# EAGLE design picoAva-Rev3-Boost (EAGLE 6.2)
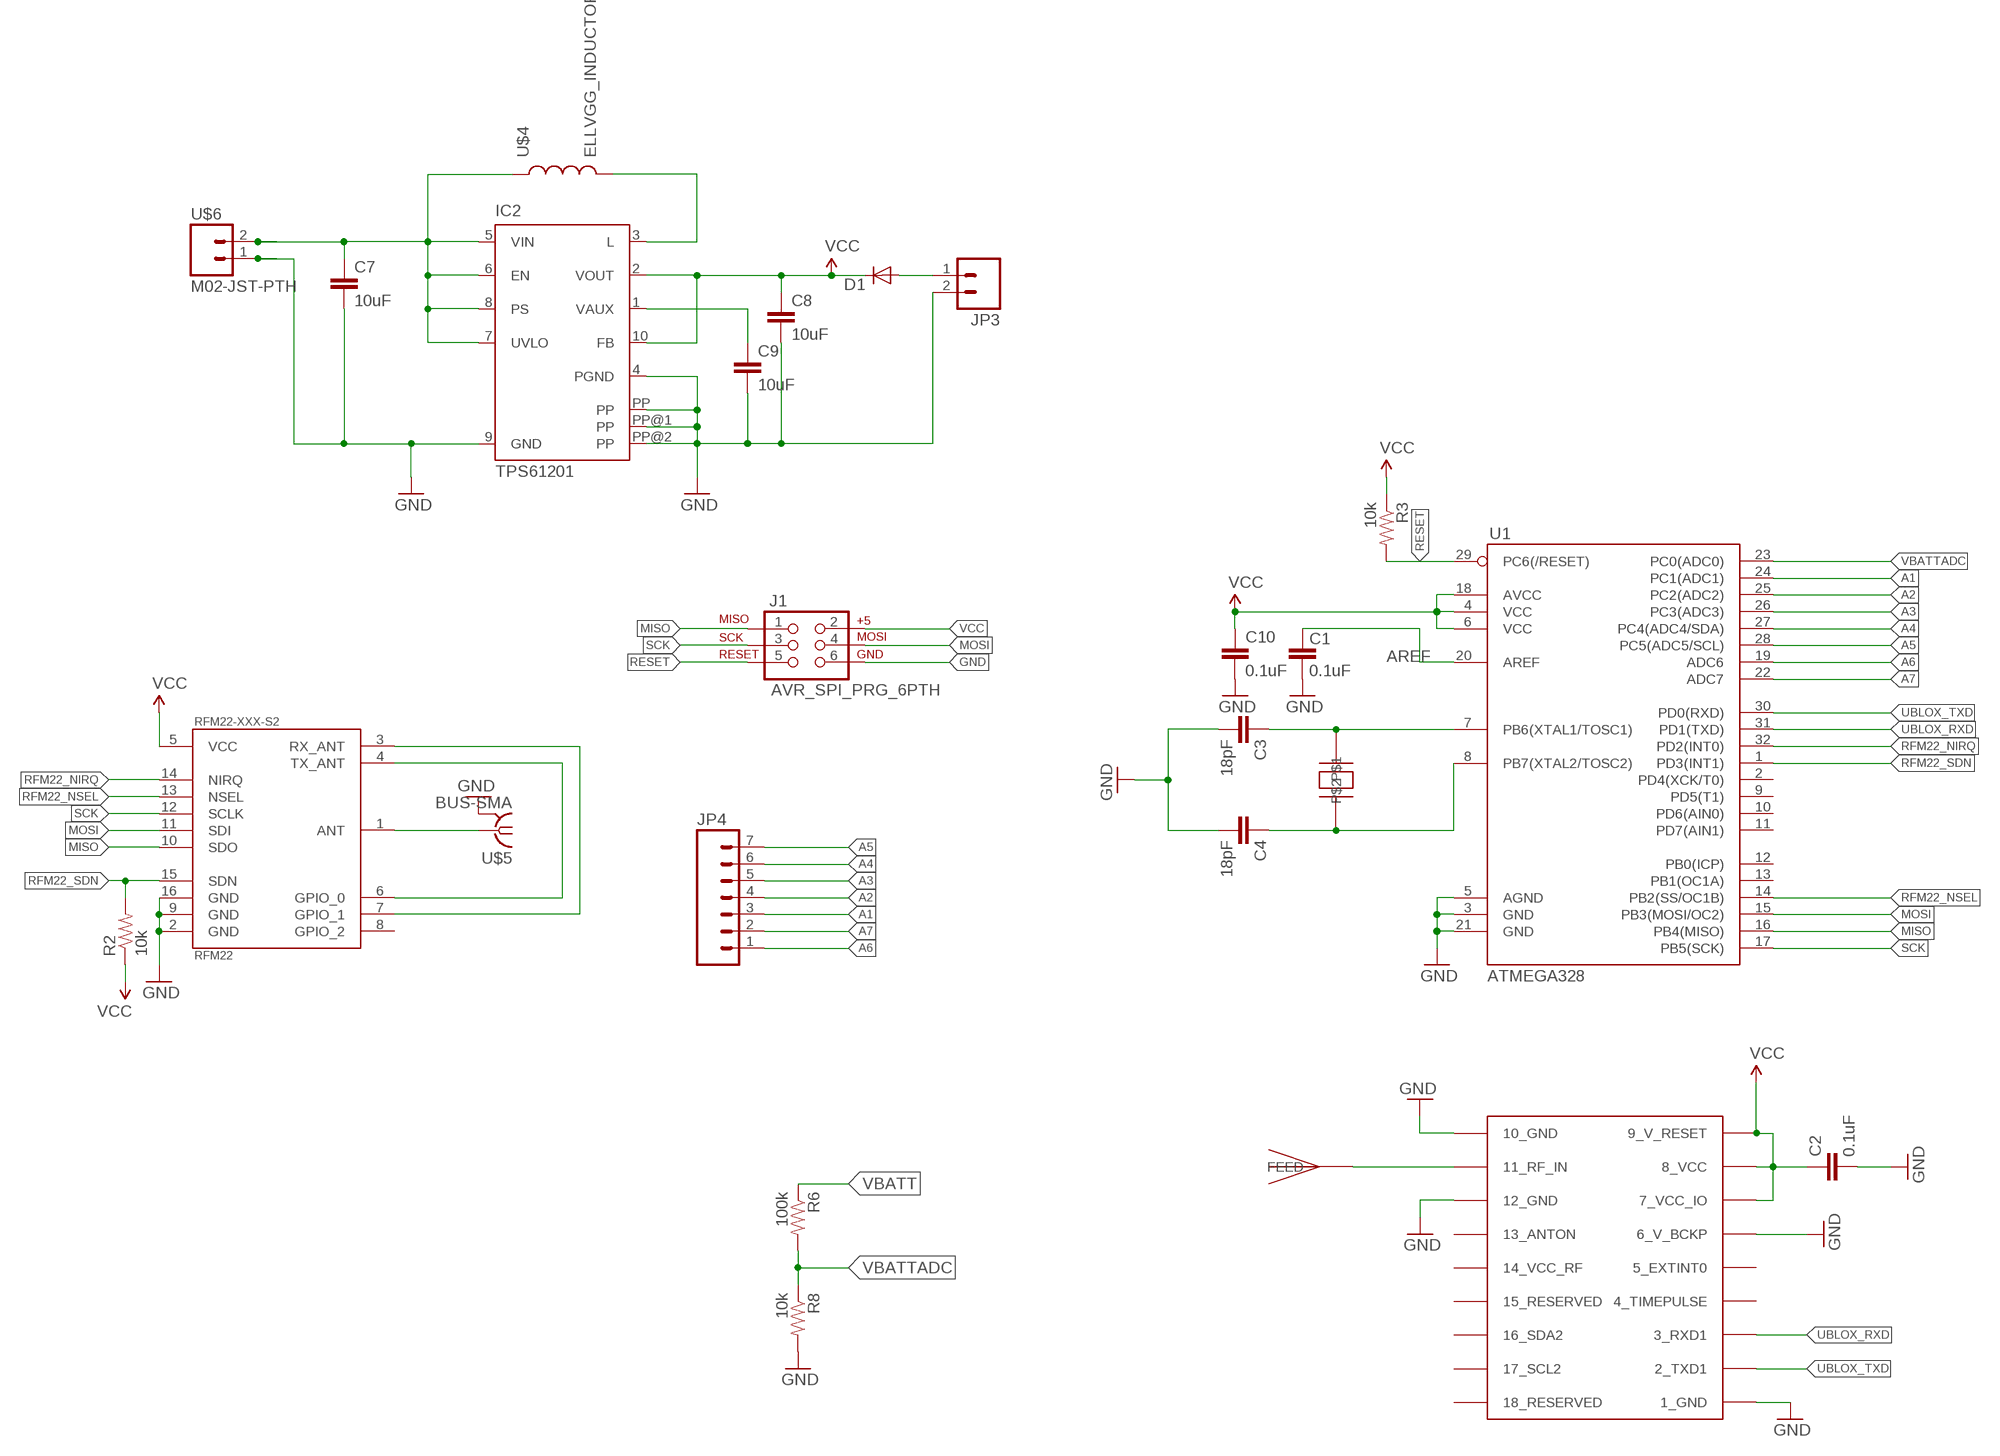
[diagram p0: schematic, sheet 1]

## Parts
C1  0.1uF  CAP0402-CAP  [0402-CAP]
C2  0.1uF  CAP0402-CAP  [0402-CAP]
C3  18pF  CAP0402-CAP  [0402-CAP]
C4  18pF  CAP0402-CAP  [0402-CAP]
C7  10uF  CAP1206  [1206]
C8  10uF  CAP1206  [1206]
C9  10uF  CAP1206  [1206]
C10  0.1uF  CAP0402-CAP  [0402-CAP]
D1  DIODESMA  [SMA-DIODE]
IC2  TPS61201  [S-PDSO-N10]
J1  AVR_SPI_PRG_6PTH  [2X3]
JP3  M02PTH  [1X02]
JP4  M07  [1X07]
R2  10k  RESISTOR0402-RES  [0402-RES]
R3  10k  RESISTOR0402-RES  [0402-RES]
R6  100k  RESISTOR0402-RES  [0402-RES]
R8  10k  RESISTOR0402-RES  [0402-RES]
RFM22-XXX-S2  RFM22  [RFM22-XXX-S2]
U1  ATMEGA328  ATMEGA168  [TQFP32-08]
U$1  UBLOX_MAX-6  [UBLOX_MAX-6]
U$2  ABRACON_ABM3_CRYSTAL  [ABRACON_ABM3_CRYSTAL]
U$3  JTI_ANTENNA-1575AT43A40  [JTI_ANTENNA-1575AT43A40]
U$4  ELLVGG_INDUCTOR  [ELLVGG_INDUCTOR]
U$5  BUS-SMA  [BUS-SMA]
U$6  M02-JST-PTH  [M02-JST-PTH]

## Nets
A1: JP4.3 U1.24(PC1(ADC1))
A2: JP4.4 U1.25(PC2(ADC2))
A3: JP4.5 U1.26(PC3(ADC3))
A4: JP4.6 U1.27(PC4(ADC4/SDA))
A5: JP4.7 U1.28(PC5(ADC5/SCL))
A6: JP4.1 U1.19(ADC6)
A7: JP4.2 U1.22(ADC7)
AREF: C1.2 U1.20(AREF)
GND [vcc]: C1.1 C2.2 C3.2 C4.2 C7.2 C8.2 C9.2 C10.2 IC2.4(PGND) IC2.9(GND) IC2.PP IC2.PP@1(PP) IC2.PP@2(PP) J1.6 JP3.2 R8.2 RFM22-XXX-S2.2(GND) RFM22-XXX-S2.9(GND) RFM22-XXX-S2.16(GND) U1.3(GND) U1.5(AGND) U1.21(GND) U$1.1_GND U$1.6_V_BCKP U$1.10_GND U$1.12_GND U$5.2(GND) U$5.3(GND) U$5.4(GND) U$5.5(GND) U$6.1
MISO: J1.1 RFM22-XXX-S2.10(SDO) U1.16(PB4(MISO))
MOSI: J1.4 RFM22-XXX-S2.11(SDI) U1.15(PB3(MOSI/OC2))
N$1: D1.A JP3.1
N$3: RFM22-XXX-S2.1(ANT) U$5.1
N$4: U$1.11_RF_IN U$3.FEED
N$5: RFM22-XXX-S2.3(RX_ANT) RFM22-XXX-S2.7(GPIO_1)
N$6: RFM22-XXX-S2.4(TX_ANT) RFM22-XXX-S2.6(GPIO_0)
N$7: IC2.3(L) U$4.P$2
N$9: C3.1 U1.7(PB6(XTAL1/TOSC1)) U$2.P$2
N$10: C4.1 U1.8(PB7(XTAL2/TOSC2)) U$2.P$1
N$11: C9.1 IC2.1(VAUX)
RESET: J1.5 R3.2 U1.29(PC6(/RESET))
RFM22_NIRQ: RFM22-XXX-S2.14(NIRQ) U1.32(PD2(INT0))
RFM22_NSEL: RFM22-XXX-S2.13(NSEL) U1.14(PB2(SS/OC1B))
RFM22_SDN: R2.2 RFM22-XXX-S2.15(SDN) U1.1(PD3(INT1))
SCK: J1.3 RFM22-XXX-S2.12(SCLK) U1.17(PB5(SCK))
UBLOX_RXD: U1.31(PD1(TXD)) U$1.3_RXD1
UBLOX_TXD: U1.30(PD0(RXD)) U$1.2_TXD1
VBATT [vcc]: C7.1 IC2.5(VIN) IC2.6(EN) IC2.7(UVLO) IC2.8(PS) R6.1 U$4.P$1 U$6.2
VBATTADC: R6.2 R8.1 U1.23(PC0(ADC0))
VCC: C2.1 C8.1 C10.1 D1.C IC2.2(VOUT) IC2.10(FB) J1.2 R2.1 R3.1 RFM22-XXX-S2.5(VCC) U1.4(VCC) U1.6(VCC) U1.18(AVCC) U$1.7_VCC_IO U$1.8_VCC U$1.9_V_RESET
Unconnected: RFM22-XXX-S2.8(GPIO_2) U1.2(PD4(XCK/T0)) U1.9(PD5(T1)) U1.10(PD6(AIN0)) U1.11(PD7(AIN1)) U1.12(PB0(ICP)) U1.13(PB1(OC1A)) U$1.4_TIMEPULSE U$1.5_EXTINT0 U$1.13_ANTON U$1.14_VCC_RF U$1.15_RESERVED U$1.16_SDA2 U$1.17_SCL2 U$1.18_RESERVED

## Library data of the parts
C1-C4 C7-C10 = SparkFun:CAP: Capacitor Standard 0603 ceramic capacitor, and 0.1" leaded capacitor.
D1 = SparkFun:DIODE: Diode These are standard reverse protection diodes and small signal diodes. SMA package can handle up to about 1A. SOD-323 can handle about 200mA. What the SOD-323 package when ordering, there are some mfgs out there that are 5-pin packages.
IC2 = texas:TPS6120*: LOW INPUT VOLTAGE SYNCHRONOUS BOOST CONVERTER WITH 1.3-A SWITCHES Source: http://focus.ti.com/lit/ds/symlink/tps61200.pdf; MPN: TPS61201DRCT; OC_FARNELL: unknown; OC_NEWARK: 37M0068
J1 = SparkFun:AVR_SPI_PRG_6: AVR ISP 6 Pin This is the reduced ISP connector for AVR programming. Common on Arduino. This footprint will take up less PCB space and can be used with a 10-pin to 6-pin adapter such as SKU: BOB-08508
JP3 = SparkFun:M02: Header 2 Standard 2-pin 0.1" header. Use with straight break away headers (SKU : PRT-00116), right angle break away headers (PRT-00553), swiss pins (PRT-00743), machine pins (PRT-00117), and female headers (PRT-00115). Molex polarized connector foot print use with SKU : PRT-08233 with associated crimp pins and housings.
JP4 = SparkFun:M07: Header 7 Standard 7-pin 0.1" header. Use with straight break away headers (SKU : PRT-00116), right angle break away headers (PRT-00553), swiss pins (PRT-00743), machine pins (PRT-00117), and female headers (PRT-00115). NOTES ON THE VARIANTS LOCK and LOCK_LONGPADS... This footprint was designed to help hold the alignment of a through-hole component (i.e. 7-pin header) while soldering it into place. You may notice that each hole has been shifted either up or down by 0.005 of an inch from it's more standard position (which is usually a perfectly straight line). This slight alteration caused the pins (the squares in the middle) to touch the edges of the holes. Because they are alternating, it causes a "brace" to hold the header in place. 0.005 has proven to be the perfect amount of "off-center" position when using our standard breakaway headers. Although looks a little odd when you look at the bare footprint, once you have a header in there, the alteration is very hard to notice. Also, if you push a header all the way into place, it is covered up entirely on the bottom side. This idea of altering the position of holes to aid alignment will be further integrated into the Sparkfun Library for other footprints. It can help hold any component with 3 or more connection pins.
R2 R3 R6 R8 = SparkFun:RESISTOR: Resistor Basic schematic elements and footprints for 0603, 1206, and PTH resistors.
RFM22-XXX-S2 = SparkFun:RFM22: *Hope RF's RFM22* Packages: RFM22-S2 (SMD)
U1 = SparkFun:ATMEGA168
U$1 = ava:UBLOX_MAX-6: UBLOX MAX-6
U$2 = ava:ABRACON_ABM3_CRYSTAL
U$3 = ava:JTI_ANTENNA-1575AT43A40
U$4 = ava:ELLVGG_INDUCTOR
U$5 = ava:BUS-SMA
U$6 = ava:M02-JST-PTH

## Net classes
0 default: width 0.203 mm
1 vcc: width 0.254 mm

## Board
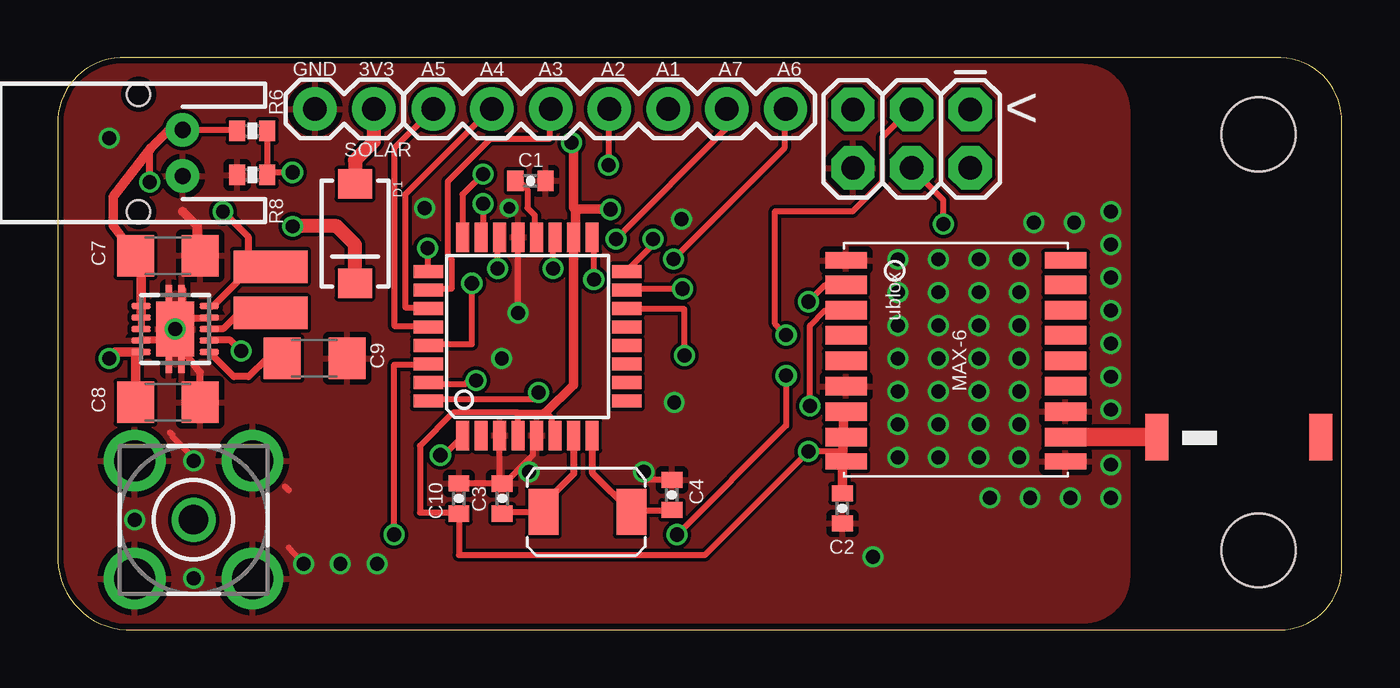
[diagram p1: board, top side]
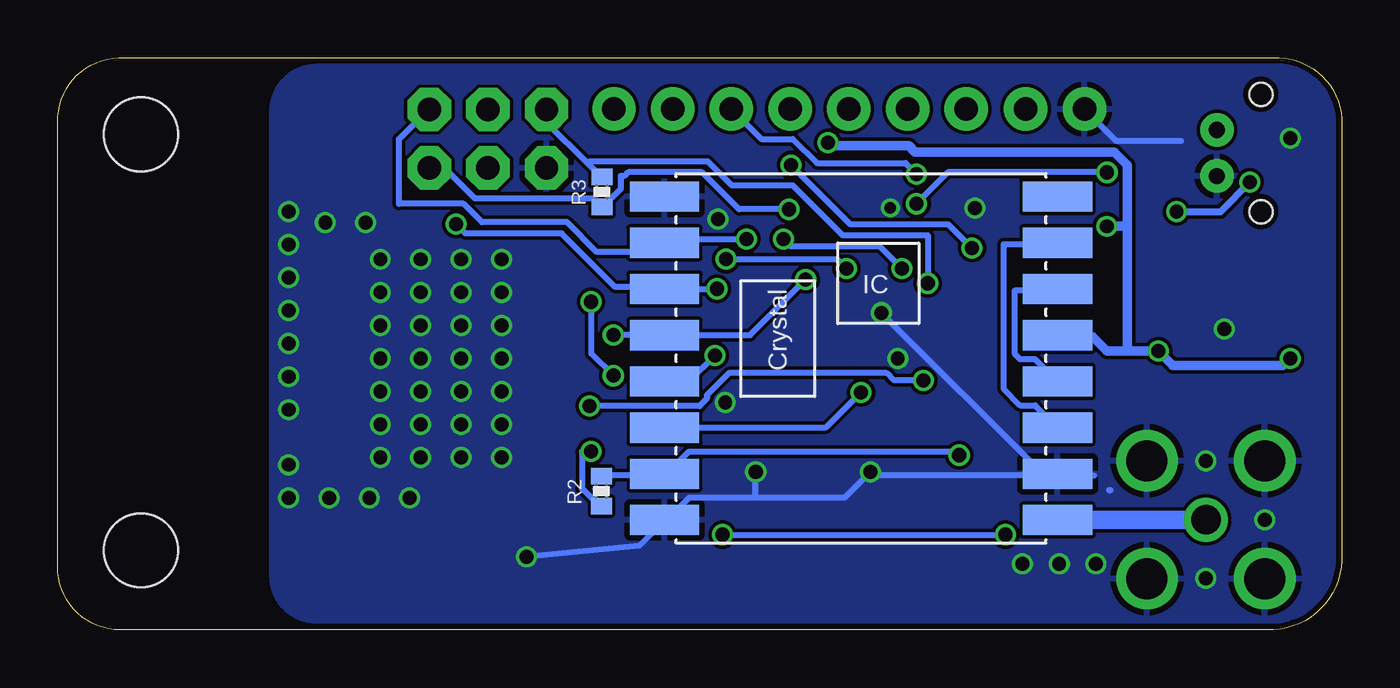
[diagram p2: board, bottom side, seen from below]

Size 55.55 x 24.77 mm. Coordinates in mm from the lower left corner, seen from the top.
Outline: 0,22.13 0,3.28 arc90 2.95,0.01 52.6,0.01 arc90 55.55,2.49 55.55,21.97 arc90 52.92,24.76 2.95,24.76 arc90 0,22.13
Copper layers (1*16): Top 0.035mm / dielectric 1.5mm / Bottom 0.035mm
Design rules: minimum track width 6mil, minimum drill 12mil, track to track 6mil, track to pad 6mil, pad to pad 6mil, via to via 6mil, smd to smd 0mil, copper to edge 10mil, drill to drill 10mil, minimum pad ring 10mil, minimum via ring 6mil, stop-mask expansion 2mil, vias tented up to drill 100mil, thermal gap 10mil
Holes 3.2 mm at 51.95,21.45 51.95,3.45

### Footprints (pad centres in the part's own frame; a part is rotated, then mirrored left to right if it is on the bottom)
0402-CAP = smd 0.7 x 0.9: 1 -0.65,0; 2 0.65,0
1206 = smd 1.6 x 1.8: 1 -1.4,0; 2 1.4,0
SMA-DIODE = smd 1.27 x 1.47: A -2.15,0; C 2.15,0
S-PDSO-N10 = smd 0.28 x 0.85: 1 -1,-1.475; 2 -0.5,-1.475; 3 0,-1.475; 4 0.5,-1.475; 5 1,-1.475; 6 1,1.475; 7 0.5,1.475; 8 0,1.475; 9 -0.5,1.475; 10 -1,1.475 | smd 2.4 x 1.65: PP 0,0 | smd 3.8 x 0.28: PP@1 0,0.275; PP@2 0,-0.275
2X3 = drill 1.016 pad 1.88 octagon: 1 0,0; 2 0,2.54; 3 2.54,0; 4 2.54,2.54; 5 5.08,0; 6 5.08,2.54
1X02 = drill 1.016 pad 1.88: 1 0,0; 2 2.54,0
1X07 = drill 1.016 pad 1.88: 1 0,0; 2 2.54,0; 3 5.08,0; 4 7.62,0; 5 10.16,0; 6 12.7,0; 7 15.24,0
0402-RES = smd 0.7 x 0.9: 1 -0.65,0; 2 0.65,0
RFM22-XXX-S2 = smd 3 x 1.3: 1 -8.5,7; 2 -8.5,5; 3 -8.5,3; 4 -8.5,1; 5 -8.5,-1; 6 -8.5,-3; 7 -8.5,-5; 8 -8.5,-7; 9 8.5,-7; 10 8.5,-5; 11 8.5,-3; 12 8.5,-1; 13 8.5,1; 14 8.5,3; 15 8.5,5; 16 8.5,7
TQFP32-08 = smd 1.27 x 0.559: 1 -4.293,2.8; 2 -4.293,2; 3 -4.293,1.2; 4 -4.293,0.4; 5 -4.293,-0.4; 6 -4.293,-1.2; 7 -4.293,-2; 8 -4.293,-2.8; 17 4.293,-2.8; 18 4.293,-2; 19 4.293,-1.2; 20 4.293,-0.4; 21 4.293,0.4; 22 4.293,1.2; 23 4.293,2; 24 4.293,2.8 | smd 0.559 x 1.27: 9 -2.8,-4.293; 10 -2,-4.293; 11 -1.2,-4.293; 12 -0.4,-4.293; 13 0.4,-4.293; 14 1.2,-4.293; 15 2,-4.293; 16 2.8,-4.293; 25 2.8,4.293; 26 2,4.293; 27 1.2,4.293; 28 0.4,4.293; 29 -0.4,4.293; 30 -1.2,4.293; 31 -2,4.293; 32 -2.8,4.293
UBLOX_MAX-6 = smd 1.8 x 0.7: 1_GND 4.95,-4.4; 9_V_RESET 4.95,4.3; 10_GND -4.55,4.3; 18_RESERVED -4.55,-4.4 | smd 1.8 x 0.8: 2_TXD1 4.95,-3.35; 3_RXD1 4.95,-2.25; 4_TIMEPULSE 4.95,-1.15; 5_EXTINT0 4.95,-0.05; 6_V_BCKP 4.95,1.05; 7_VCC_IO 4.95,2.15; 8_VCC 4.95,3.25; 11_RF_IN -4.55,3.25; 12_GND -4.55,2.15; 13_ANTON -4.55,1.05; 14_VCC_RF -4.55,-0.05; 15_RESERVED -4.55,-1.15; 16_SDA2 -4.55,-2.25; 17_SCL2 -4.55,-3.35
ABRACON_ABM3_CRYSTAL = smd 1.3 x 2: P$1 -3.4,0.1; P$2 0.4,0.1
JTI_ANTENNA-1575AT43A40 = smd 1 x 2: FEED -3.81,-1.27; NC 3.29,-1.27
ELLVGG_INDUCTOR = smd 1.4 x 3.2: P$1 -0.953,0; P$2 1.048,0
BUS-SMA = drill 1.27: 1 0,0 | drill 1.778: 2 -2.55,2.55; 3 2.55,2.55; 4 2.55,-2.55; 5 -2.55,-2.55
M02-JST-PTH = drill 0.7 pad 1.448: 1 -1,0; 2 1,0 | hole 1: -2.54,1.905; 2.54,1.905

### Placement (x,y rotation side)
C1  20.45,19.44 180 top
C2  33.94,5.26 270 top
C3  19.23,5.69 90 top
C4  26.57,5.85 90 top
C7  4.76,16.2 0 top
C8  4.76,9.85 0 top
C9  11.11,11.76 0 top
C10  17.35,5.69 90 top
D1  12.86,17.16 270 top
IC2  5.08,13.03 90 top
J1  39.48,22.53 180 top
JP3  13.67,22.55 180 top
JP4  31.49,22.55 180 top
R2  32.03,6.01 90 bottom
R3  32.01,18.96 90 bottom
R6  8.42,21.6 0 top
R8  8.42,19.7 180 top
RFM22-XXX-S2  20.8,11.76 180 bottom
U1  20.32,12.71 90 top
U$1  39.05,11.6 180 top
U$2  21.42,5.21 180 top
U$3  51.36,9.61 0 top
U$4  9.21,14.77 270 top
U$5  5.88,4.77 0 top
U$6  5.4,20.65 90 top

### Tracks (layer width: path | path; a pad name or v marks a point on that pad's centre or on a via)
A1  (via drill 0.61)
  Top 0.254: v18.39,19.73 17.51,18.85 U1.24
  Bottom 0.254: v18.39,19.73 18.87,20.21 22.71,20.21 23.75,21.25 25.11,21.25 26.39,22.53 JP4.3
A2  (via drill 0.61)
  Top 0.254: v15.99,16.53 15.99,15.57 U1.25 | v23.83,20.13 23.83,22.53 JP4.4
  Bottom 0.254: v15.99,16.53 17.03,17.57 21.27,17.57 v23.83,20.13
A3
  Top 0.254: U1.26 16.07,14.77 17.03,14.77 17.03,16.05 16.87,16.21 16.87,19.41 18.71,21.25 21.27,21.25 21.27,22.53 JP4.5
A4
  Top 0.254: U1.27 15.99,13.97 15.03,13.97 15.03,18.85 18.71,22.53 JP4.6
A5
  Top 0.254: U1.28 15.99,13.17 14.55,13.17 14.55,20.85 16.23,22.53 JP4.7
A6  (via drill 0.61)
  Top 0.254: v21.43,15.65 21.43,16.85 21.51,16.93 U1.19 | v26.63,16.05 31.43,20.85 31.43,22.53 JP4.1
  Bottom 0.254: v21.43,15.65 21.83,16.05 v26.63,16.05
A7  (via drill 0.61)
  Top 0.254: v19.03,15.65 19.03,16.85 19.11,16.93 U1.22 | v24.15,16.93 28.87,21.65 28.87,22.53 JP4.2
  Bottom 0.254: v19.03,15.65 19.99,16.61 23.83,16.61 v24.15,16.93
AREF
  Top 0.254: C1.2 19.94,19.44 20.32,19.06 20.32,18.27 20.64,17.95 20.64,17.09 U1.20
GND  (via drill 0.5, 0.6, 0.61)
  Top 0.254: v3.33,4.77 3.35,4.77 v3.32,4.77 | IC2.PP@1 4.95,13.01 IC2.PP 5.19,13.09 5.27,13.09 IC2.PP@2 | 5.91,2.45 v5.87,2.23 | v5.87,7.31 5.83,7.49 4.95,8.37 4.95,8.45 4.86,8.54 | 9.99,3.57 v10.64,2.87 | 9.83,6.21 9.99,6.05 10,6.04 | C3.2 19.19,6.37 17.35,6.37 C10.2 | U1.3 19.11,8.37 19.11,6.45 C3.2 | 20.15,7.17 19.35,6.37 C3.2 | 20.15,7.17 20.55,7.57 20.55,8.21 20.71,8.37 U1.5 | v19.91,13.73 19.91,16.93 U1.21 | 20.15,7.17 20.39,6.93 v20.39,6.85 | v25.35,6.85 25.35,6.53 26.47,6.53 C4.2
  Top 0.305: 6.37,9.85 C8.2 6.16,11.15 5.08,12.55 IC2.PP | C7.2 6.16,15.54 | 5.4,14.77 5.4,13.07 | 5.4,13.07 IC2.PP@2 | 5.4,13.07 5.44,13.07 5.87,13.5 6.53,13.5 IC2.4 | IC2.PP@1 4.76,13.03 4.29,12.55 3.63,12.55 | 5.45,19.7 U$6.1 | 12.07,11.32 C9.2
  Top 0.406: 5.4,18.11 6.03,17.47 6.03,16.33 C7.2
  Bottom 0.254: 6.95,21.17 9.75,21.17 11.11,22.53 JP3.2 | 5.43,19.65 U$6.1 | v35.27,3.17 30.39,3.65 29.35,4.69 RFM22-XXX-S2.16 29.19,4.77 28.23,5.73 25.35,5.73 | v19.91,13.73 12.95,6.77 12.31,6.77 RFM22-XXX-S2.2 | RFM22-XXX-S2.2 13.03,6.69 20.23,6.69 v20.39,6.85 21.51,5.73 25.35,5.73 | 25.35,5.73 v25.35,6.85 | 10.71,6.69 12.23,6.69 RFM22-XXX-S2.2 | 10.07,6.05 10,6.04
  other vias: 5.08,13.03 45.56,9.54 45.56,7.15 2.22,21.28 15.88,18.27 19.21,11.76 26.99,17.79 26.67,9.85 41.59,7.47 36.36,7.47 38.1,7.47 39.85,7.47 41.59,10.33 36.36,10.33 38.1,10.33 39.85,10.33 41.59,11.76 36.36,11.76 38.1,11.76 39.85,11.76 41.59,8.9 36.36,8.9 38.1,8.9 39.85,8.9 41.59,13.19 36.36,13.19 38.1,13.19 39.85,13.19 41.59,14.62 36.36,14.62 38.1,14.62 39.85,14.62 41.59,16.04 36.36,16.04 38.1,16.04 39.85,16.04 19.53,18.27 45.56,10.96 45.56,13.82 45.56,12.39 45.56,15.25 45.56,16.68 45.56,5.73 40.32,5.73 42.07,5.73 43.82,5.73 45.56,18.11 43.98,17.63 42.23,17.63 12.23,2.87 13.81,2.87
  pour Top (isolate 0.1): 0,24.46 44.36,24.46 arc-90 46.36,22.46 46.36,2.33 arc-90 44.36,0.33 0,0.33
  pour Bottom (isolate 0.1): 0,24.46 44.36,24.46 arc-90 46.36,22.46 46.36,2.33 arc-90 44.36,0.33 0,0.33
MISO  (via drill 0.61)
  Top 0.254: v25.75,16.93 25.75,16.69 24.63,15.57 U1.16
  Bottom 0.254: v25.75,16.93 29.11,16.93 29.27,16.77 RFM22-XXX-S2.10 29.35,16.69 29.67,16.37 32.23,16.37 33.51,17.65 37.19,17.65 37.99,18.45 40.79,18.45 40.79,21.25 39.51,22.53 J1.1
MOSI  (via drill 0.61)
  Top 0.254: v27.03,14.77 24.63,14.77 U1.15 | v38.31,17.57 38.31,18.61 36.95,19.97 J1.4
  Bottom 0.254: v27.03,14.77 29.27,14.77 RFM22-XXX-S2.11 29.35,14.85 31.43,14.85 33.75,17.17 37.91,17.17 v38.31,17.57
N$1
  Top 0.61: JP3.1 13.67,21.14 12.86,20.33 D1.A
N$3
  Bottom 0.8: RFM22-XXX-S2.1 5.89,4.76
  Bottom 1.016: 5.89,4.76 U$5.1
N$4
  Top 0.8: U$1.11_RF_IN 47.38,8.35 U$3.FEED
N$5
  Bottom 0.254: RFM22-XXX-S2.3 12.31,8.77 13.27,9.73 13.91,9.73 14.63,10.45 14.63,16.69 12.31,16.69 RFM22-XXX-S2.7
N$6
  Bottom 0.254: RFM22-XXX-S2.4 12.31,10.77 13.27,11.73 13.91,11.73 14.15,11.97 14.15,14.69 12.31,14.69 RFM22-XXX-S2.6
N$7
  Top 0.305: U$4.P$2 7.84,13.73 7.14,13.03 IC2.3
N$9
  Top 0.254: C3.1 19.27,5.09 20.87,5.09 U$2.P$2
  Top 0.305: U1.7 22.32,6.77 21.43,5.87 21.43,5.52 U$2.P$2
N$10
  Top 0.254: C4.1 26.55,5.17 24.95,5.17 U$2.P$1
  Top 0.305: U1.8 23.12,6.81 U$2.P$1
N$11
  Top 0.305: C9.1 9.05,11.76 8.26,10.96 7.62,10.96 IC2.1
RESET  (via drill 0.61)
  Top 0.254: v17.91,15.01 17.91,12.37 16.07,12.37 U1.29
  Bottom 0.254: 32.63,20.21 34.39,21.97 J1.5 | 32.63,20.21 32.07,19.65 R3.2 | v17.91,15.01 17.91,17.09 21.59,17.09 23.75,19.25 26.39,19.25 27.43,20.29 32.55,20.29 32.63,20.21
RFM22_NIRQ  (via drill 0.61)
  Top 0.254: v20.79,10.29 20.79,9.97 16.07,9.97 U1.32
  Bottom 0.254: v20.79,10.29 22.31,8.77 29.27,8.77 RFM22-XXX-S2.14
RFM22_NSEL  (via drill 0.61)
  Top 0.254: v27.11,11.89 27.11,13.89 24.63,13.89 U1.14
  Bottom 0.254: v27.11,11.89 28.23,10.77 29.27,10.77 RFM22-XXX-S2.13
RFM22_SDN  (via drill 0.61)
  Top 0.254: v16.55,7.57 16.71,7.57 17.51,8.37 U1.1
  Bottom 0.254: R2.2 31.99,6.69 29.35,6.69 RFM22-XXX-S2.15 29.19,6.77 28.23,7.73 16.71,7.73 v16.55,7.57
SCK  (via drill 0.61)
  Top 0.254: v23.19,15.17 23.19,16.93 U1.17 | v31.51,12.77 31.03,13.25 31.03,18.13 34.39,18.13 35.67,19.41 35.67,21.33 36.87,22.53 J1.3
  Bottom 0.254: v23.19,15.17 25.59,12.77 29.27,12.77 RFM22-XXX-S2.12 29.35,12.77 v31.51,12.77
UBLOX_RXD  (via drill 0.6)
  Top 0.254: 15.99,10.69 U1.31 16.03,10.65 17.62,10.65 17.78,10.81 v18.1,10.81 | v32.54,9.69 32.54,13.19 33.18,13.82 33.97,13.82 U$1.3_RXD1
  Bottom 0.254: v32.54,9.69 27.78,9.69 27.46,10.01 27.46,10.17 26.51,11.12 19.69,11.12 19.37,10.81 v18.1,10.81
UBLOX_TXD  (via drill 0.61)
  Top 0.254: v14.55,4.13 14.55,11.49 15.99,11.49 U1.30 | v26.79,4.13 31.51,8.85 v31.51,11.01 | v32.47,14.21 33.19,14.93 34.07,14.93 U$1.2_TXD1
  Bottom 0.254: v26.79,4.13 v14.55,4.13 | v31.51,11.01 32.47,11.97 v32.47,14.21
VBATT  (via drill 0.6)
  Top 0.254: U$6.2 7.72,21.65
  Top 0.305: C7.1 3.61,16.2 | 8.26,15.57 U$4.P$1 | IC2.7 IC2.8 | 8.26,15.57 8.41,15.73 | IC2.5 6.72,14.03 8.26,15.57 | 8.26,15.57 8.26,17 v7.14,18.11 | v3.97,19.38 3.97,20.81 4.05,20.89 | 7.72,21.65 R6.1
  Top 0.406: 3.61,16.2 IC2.6 IC2.7 | U$6.2 4.81,21.65 4.05,20.89 2.39,18.75 2.39,17.5 C7.1
  Bottom 0.305: v7.14,18.11 5.24,18.11 v3.97,19.38
VBATTADC  (via drill 0.61)
  Top 0.254: R6.2 R8.1 9.19,19.81 v10.15,19.81 | v18.39,18.45 18.39,17.01 U1.23
  Bottom 0.254: v18.39,18.45 17.03,19.81 v10.15,19.81
VCC  (via drill 0.6, 0.61)
  Top 0.254: 6.58,12.55 IC2.2 | 34.15,7.33 U$1.9_V_RESET | 34.15,8.29 U$1.8_VCC | 33.99,9.25 U$1.7_VCC_IO | 33.99,8.29 U$1.8_VCC | 19.91,9.41 17.11,9.41 15.67,7.97 15.67,5.09 17.35,5.09 C10.1 17.35,3.25 27.99,3.25 v32.47,7.73 33.97,7.73 33.97,7.63 34.13,7.47 U$1.9_V_RESET | 19.91,9.41 19.91,8.45 U1.4 | 19.91,9.41 21.11,9.41 21.35,9.17 21.35,8.61 21.51,8.45 U1.6 | 22.31,16.93 U1.18 22.39,17.09 | 22.31,21.01 v22.23,21.09 | 22.31,18.29 22.39,18.21 | 33.81,7.31 U$1.9_V_RESET | 33.97,8.11 U$1.8_VCC
  Top 0.305: 3.36,11.79 IC2.10 | v7.94,12.07 7.46,12.55 6.58,12.55
  Top 0.406: C8.1 3.36,11.79 | IC2.10 2.49,12.03 v2.22,11.76 | 33.99,8.29 33.99,9.25 | 22.31,16.93 22.31,10.61 21.11,9.41 | v23.91,18.21 22.39,18.21 22.39,17.09 | 22.31,18.29 22.31,21.01 | C2.1 33.94,7.18 U$1.9_V_RESET | 33.97,7.73 33.97,8.11
  Top 0.61: D1.C 12.86,16.68 12.07,17.47 v10.16,17.47
  Bottom 0.254: J1.2 39.43,19.97 38.79,19.97 37.51,18.69 32.39,18.69 32.07,18.37 R3.1 31.91,18.37 31.19,19.09 31.19,19.65 31.03,19.65 30.87,19.81 27.67,19.81 26.07,18.21 v23.91,18.21 | 32.07,5.33 R2.1 32.15,5.41 32.87,6.13 32.87,7.73 v32.47,7.73
  Bottom 0.305: 10.8,12.71 12.25,12.71 RFM22-XXX-S2.5
  Bottom 0.406: v2.22,11.76 2.54,11.44 7.3,11.44 v7.94,12.07 9.27,12.07 | 9.27,12.07 10.16,12.07 10.8,12.71 | 9.27,12.07 9.27,17.47 | 9.27,17.47 9.27,20.13 9.83,20.69 18.46,20.69 18.73,20.96 22.11,20.96 v22.23,21.09 | v10.16,17.47 9.27,17.47

### Text on the board
tPlace: GND | 3V3 | A5 | A4 | A3 | A2 | A1 | A7 | A6 | < | SOLAR
tStop: µAva2-B | If found contact ukhasrecovery@gmail.com | M0UPU 2012